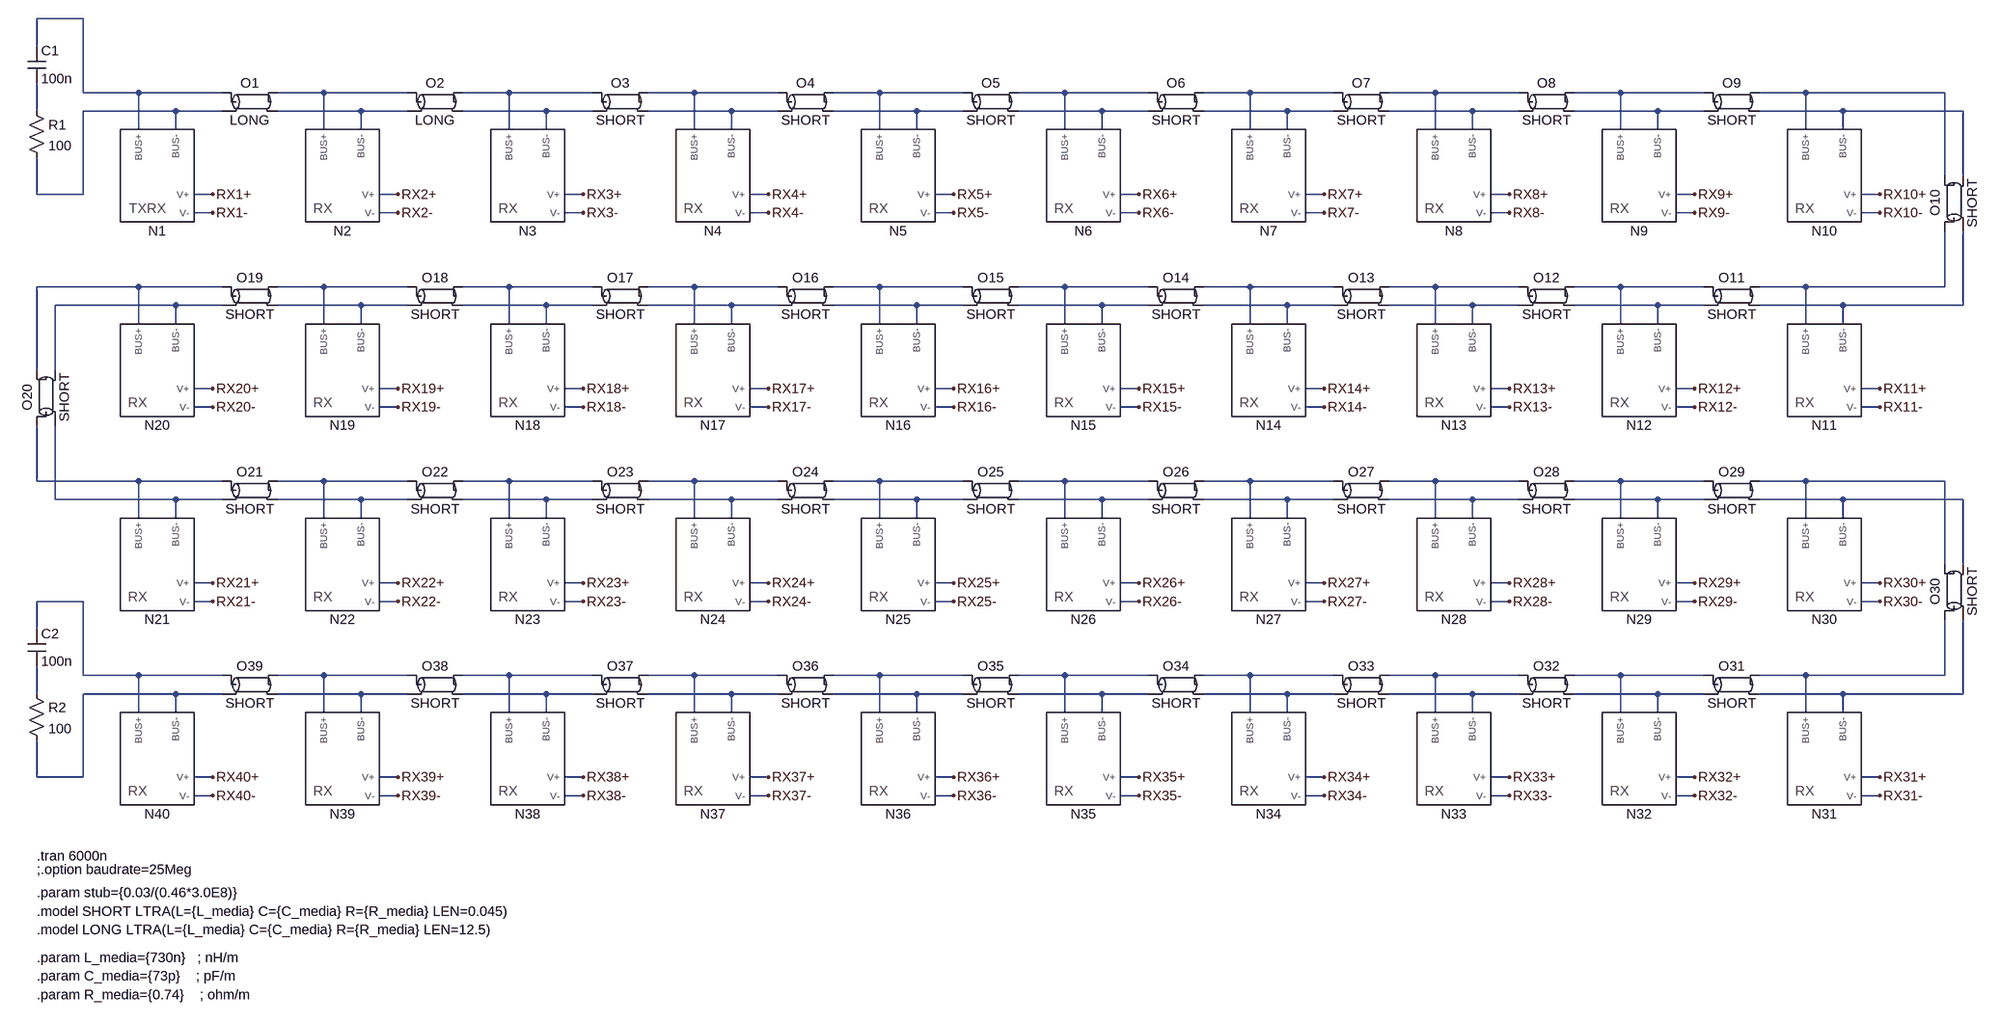
[diagram p0: schematic Multidrop_Bus.asc]
Multidrop_Bus.asc, the LTspice schematic file:
Version 4
SHEET 1 4756 1620
WIRE 1152 -640 1072 -640
WIRE 1072 -592 1072 -640
WIRE 1152 -512 1152 -640
WIRE 1248 -512 1152 -512
WIRE 1392 -512 1248 -512
WIRE 1568 -512 1488 -512
WIRE 1712 -512 1568 -512
WIRE 1888 -512 1808 -512
WIRE 2032 -512 1888 -512
WIRE 2208 -512 2128 -512
WIRE 2352 -512 2208 -512
WIRE 2528 -512 2448 -512
WIRE 2672 -512 2528 -512
WIRE 2848 -512 2768 -512
WIRE 2992 -512 2848 -512
WIRE 3168 -512 3088 -512
WIRE 3312 -512 3168 -512
WIRE 3488 -512 3408 -512
WIRE 3632 -512 3488 -512
WIRE 3808 -512 3728 -512
WIRE 3952 -512 3808 -512
WIRE 4128 -512 4048 -512
WIRE 4368 -512 4128 -512
WIRE 1072 -480 1072 -528
WIRE 1312 -480 1152 -480
WIRE 1392 -480 1312 -480
WIRE 1632 -480 1488 -480
WIRE 1712 -480 1632 -480
WIRE 1952 -480 1808 -480
WIRE 2032 -480 1952 -480
WIRE 2272 -480 2128 -480
WIRE 2352 -480 2272 -480
WIRE 2592 -480 2448 -480
WIRE 2672 -480 2592 -480
WIRE 2912 -480 2768 -480
WIRE 2992 -480 2912 -480
WIRE 3232 -480 3088 -480
WIRE 3312 -480 3232 -480
WIRE 3552 -480 3408 -480
WIRE 3632 -480 3552 -480
WIRE 3872 -480 3728 -480
WIRE 3952 -480 3872 -480
WIRE 4192 -480 4048 -480
WIRE 4400 -480 4192 -480
WIRE 1248 -448 1248 -512
WIRE 1312 -448 1312 -480
WIRE 1568 -448 1568 -512
WIRE 1632 -448 1632 -480
WIRE 1888 -448 1888 -512
WIRE 1952 -448 1952 -480
WIRE 2208 -448 2208 -512
WIRE 2272 -448 2272 -480
WIRE 2528 -448 2528 -512
WIRE 2592 -448 2592 -480
WIRE 2848 -448 2848 -512
WIRE 2912 -448 2912 -480
WIRE 3168 -448 3168 -512
WIRE 3232 -448 3232 -480
WIRE 3488 -448 3488 -512
WIRE 3552 -448 3552 -480
WIRE 3808 -448 3808 -512
WIRE 3872 -448 3872 -480
WIRE 4128 -448 4128 -512
WIRE 4192 -448 4192 -480
WIRE 4368 -368 4368 -512
WIRE 4400 -368 4400 -480
WIRE 1072 -336 1072 -400
WIRE 1152 -336 1152 -480
WIRE 1152 -336 1072 -336
WIRE 1376 -336 1344 -336
WIRE 1696 -336 1664 -336
WIRE 2016 -336 1984 -336
WIRE 2336 -336 2304 -336
WIRE 2656 -336 2624 -336
WIRE 2976 -336 2944 -336
WIRE 3296 -336 3264 -336
WIRE 3616 -336 3584 -336
WIRE 3936 -336 3904 -336
WIRE 4256 -336 4224 -336
WIRE 1376 -304 1344 -304
WIRE 1696 -304 1664 -304
WIRE 2016 -304 1984 -304
WIRE 2336 -304 2304 -304
WIRE 2656 -304 2624 -304
WIRE 2976 -304 2944 -304
WIRE 3296 -304 3264 -304
WIRE 3616 -304 3584 -304
WIRE 3936 -304 3904 -304
WIRE 4256 -304 4224 -304
WIRE 1248 -176 1072 -176
WIRE 1392 -176 1248 -176
WIRE 1568 -176 1488 -176
WIRE 1712 -176 1568 -176
WIRE 1888 -176 1808 -176
WIRE 2032 -176 1888 -176
WIRE 2208 -176 2128 -176
WIRE 2352 -176 2208 -176
WIRE 2528 -176 2448 -176
WIRE 2672 -176 2528 -176
WIRE 2848 -176 2768 -176
WIRE 2992 -176 2848 -176
WIRE 3168 -176 3088 -176
WIRE 3312 -176 3168 -176
WIRE 3488 -176 3408 -176
WIRE 3632 -176 3488 -176
WIRE 3808 -176 3728 -176
WIRE 3952 -176 3808 -176
WIRE 4128 -176 4048 -176
WIRE 4368 -176 4368 -272
WIRE 4368 -176 4128 -176
WIRE 1312 -144 1104 -144
WIRE 1392 -144 1312 -144
WIRE 1632 -144 1488 -144
WIRE 1712 -144 1632 -144
WIRE 1952 -144 1808 -144
WIRE 2032 -144 1952 -144
WIRE 2272 -144 2128 -144
WIRE 2352 -144 2272 -144
WIRE 2592 -144 2448 -144
WIRE 2672 -144 2592 -144
WIRE 2912 -144 2768 -144
WIRE 2992 -144 2912 -144
WIRE 3232 -144 3088 -144
WIRE 3312 -144 3232 -144
WIRE 3552 -144 3408 -144
WIRE 3632 -144 3552 -144
WIRE 3872 -144 3728 -144
WIRE 3952 -144 3872 -144
WIRE 4192 -144 4048 -144
WIRE 4400 -144 4400 -272
WIRE 4400 -144 4192 -144
WIRE 1248 -112 1248 -176
WIRE 1312 -112 1312 -144
WIRE 1568 -112 1568 -176
WIRE 1632 -112 1632 -144
WIRE 1888 -112 1888 -176
WIRE 1952 -112 1952 -144
WIRE 2208 -112 2208 -176
WIRE 2272 -112 2272 -144
WIRE 2528 -112 2528 -176
WIRE 2592 -112 2592 -144
WIRE 2848 -112 2848 -176
WIRE 2912 -112 2912 -144
WIRE 3168 -112 3168 -176
WIRE 3232 -112 3232 -144
WIRE 3488 -112 3488 -176
WIRE 3552 -112 3552 -144
WIRE 3808 -112 3808 -176
WIRE 3872 -112 3872 -144
WIRE 4128 -112 4128 -176
WIRE 4192 -112 4192 -144
WIRE 1072 -32 1072 -176
WIRE 1104 -32 1104 -144
WIRE 1376 0 1344 0
WIRE 1696 0 1664 0
WIRE 2016 0 1984 0
WIRE 2336 0 2304 0
WIRE 2656 0 2624 0
WIRE 2976 0 2944 0
WIRE 3296 0 3264 0
WIRE 3616 0 3584 0
WIRE 3936 0 3904 0
WIRE 4256 0 4224 0
WIRE 1376 32 1344 32
WIRE 1696 32 1664 32
WIRE 2016 32 1984 32
WIRE 2336 32 2304 32
WIRE 2656 32 2624 32
WIRE 2976 32 2944 32
WIRE 3296 32 3264 32
WIRE 3616 32 3584 32
WIRE 3936 32 3904 32
WIRE 4256 32 4224 32
WIRE 1072 160 1072 64
WIRE 1248 160 1072 160
WIRE 1392 160 1248 160
WIRE 1568 160 1488 160
WIRE 1712 160 1568 160
WIRE 1888 160 1808 160
WIRE 2032 160 1888 160
WIRE 2208 160 2128 160
WIRE 2352 160 2208 160
WIRE 2528 160 2448 160
WIRE 2672 160 2528 160
WIRE 2848 160 2768 160
WIRE 2992 160 2848 160
WIRE 3168 160 3088 160
WIRE 3312 160 3168 160
WIRE 3488 160 3408 160
WIRE 3632 160 3488 160
WIRE 3808 160 3728 160
WIRE 3952 160 3808 160
WIRE 4128 160 4048 160
WIRE 4368 160 4128 160
WIRE 1104 192 1104 64
WIRE 1312 192 1104 192
WIRE 1392 192 1312 192
WIRE 1632 192 1488 192
WIRE 1712 192 1632 192
WIRE 1952 192 1808 192
WIRE 2032 192 1952 192
WIRE 2272 192 2128 192
WIRE 2352 192 2272 192
WIRE 2592 192 2448 192
WIRE 2672 192 2592 192
WIRE 2912 192 2768 192
WIRE 2992 192 2912 192
WIRE 3232 192 3088 192
WIRE 3312 192 3232 192
WIRE 3552 192 3408 192
WIRE 3632 192 3552 192
WIRE 3872 192 3728 192
WIRE 3952 192 3872 192
WIRE 4192 192 4048 192
WIRE 4400 192 4192 192
WIRE 1248 224 1248 160
WIRE 1312 224 1312 192
WIRE 1568 224 1568 160
WIRE 1632 224 1632 192
WIRE 1888 224 1888 160
WIRE 1952 224 1952 192
WIRE 2208 224 2208 160
WIRE 2272 224 2272 192
WIRE 2528 224 2528 160
WIRE 2592 224 2592 192
WIRE 2848 224 2848 160
WIRE 2912 224 2912 192
WIRE 3168 224 3168 160
WIRE 3232 224 3232 192
WIRE 3488 224 3488 160
WIRE 3552 224 3552 192
WIRE 3808 224 3808 160
WIRE 3872 224 3872 192
WIRE 4128 224 4128 160
WIRE 4192 224 4192 192
WIRE 4368 304 4368 160
WIRE 4400 304 4400 192
WIRE 1376 336 1344 336
WIRE 1696 336 1664 336
WIRE 2016 336 1984 336
WIRE 2336 336 2304 336
WIRE 2656 336 2624 336
WIRE 2976 336 2944 336
WIRE 3296 336 3264 336
WIRE 3616 336 3584 336
WIRE 3936 336 3904 336
WIRE 4256 336 4224 336
WIRE 1152 368 1072 368
WIRE 1376 368 1344 368
WIRE 1696 368 1664 368
WIRE 2016 368 1984 368
WIRE 2336 368 2304 368
WIRE 2656 368 2624 368
WIRE 2976 368 2944 368
WIRE 3296 368 3264 368
WIRE 3616 368 3584 368
WIRE 3936 368 3904 368
WIRE 4256 368 4224 368
WIRE 1072 416 1072 368
WIRE 1152 496 1152 368
WIRE 1248 496 1152 496
WIRE 1392 496 1248 496
WIRE 1568 496 1488 496
WIRE 1712 496 1568 496
WIRE 1888 496 1808 496
WIRE 2032 496 1888 496
WIRE 2208 496 2128 496
WIRE 2352 496 2208 496
WIRE 2528 496 2448 496
WIRE 2672 496 2528 496
WIRE 2848 496 2768 496
WIRE 2992 496 2848 496
WIRE 3168 496 3088 496
WIRE 3312 496 3168 496
WIRE 3488 496 3408 496
WIRE 3632 496 3488 496
WIRE 3808 496 3728 496
WIRE 3952 496 3808 496
WIRE 4128 496 4048 496
WIRE 4368 496 4368 400
WIRE 4368 496 4128 496
WIRE 1072 528 1072 480
WIRE 1312 528 1152 528
WIRE 1392 528 1312 528
WIRE 1632 528 1488 528
WIRE 1712 528 1632 528
WIRE 1952 528 1808 528
WIRE 2032 528 1952 528
WIRE 2272 528 2128 528
WIRE 2352 528 2272 528
WIRE 2592 528 2448 528
WIRE 2672 528 2592 528
WIRE 2912 528 2768 528
WIRE 2992 528 2912 528
WIRE 3232 528 3088 528
WIRE 3312 528 3232 528
WIRE 3552 528 3408 528
WIRE 3632 528 3552 528
WIRE 3872 528 3728 528
WIRE 3952 528 3872 528
WIRE 4192 528 4048 528
WIRE 4400 528 4400 400
WIRE 4400 528 4192 528
WIRE 1248 560 1248 496
WIRE 1312 560 1312 528
WIRE 1568 560 1568 496
WIRE 1632 560 1632 528
WIRE 1888 560 1888 496
WIRE 1952 560 1952 528
WIRE 2208 560 2208 496
WIRE 2272 560 2272 528
WIRE 2528 560 2528 496
WIRE 2592 560 2592 528
WIRE 2848 560 2848 496
WIRE 2912 560 2912 528
WIRE 3168 560 3168 496
WIRE 3232 560 3232 528
WIRE 3488 560 3488 496
WIRE 3552 560 3552 528
WIRE 3808 560 3808 496
WIRE 3872 560 3872 528
WIRE 4128 560 4128 496
WIRE 4192 560 4192 528
WIRE 1072 672 1072 608
WIRE 1152 672 1152 528
WIRE 1152 672 1072 672
WIRE 1376 672 1344 672
WIRE 1696 672 1664 672
WIRE 2016 672 1984 672
WIRE 2336 672 2304 672
WIRE 2656 672 2624 672
WIRE 2976 672 2944 672
WIRE 3296 672 3264 672
WIRE 3616 672 3584 672
WIRE 3936 672 3904 672
WIRE 4256 672 4224 672
WIRE 1376 704 1344 704
WIRE 1696 704 1664 704
WIRE 2016 704 1984 704
WIRE 2336 704 2304 704
WIRE 2656 704 2624 704
WIRE 2976 704 2944 704
WIRE 3296 704 3264 704
WIRE 3616 704 3584 704
WIRE 3936 704 3904 704
WIRE 4256 704 4224 704
FLAG 1376 -336 RX1+
FLAG 1376 -304 RX1-
FLAG 1696 -304 RX2-
FLAG 2016 -304 RX3-
FLAG 2336 -304 RX4-
FLAG 2656 -304 RX5-
FLAG 2976 -304 RX6-
FLAG 1696 -336 RX2+
FLAG 2016 -336 RX3+
FLAG 2336 -336 RX4+
FLAG 2656 -336 RX5+
FLAG 2976 -336 RX6+
FLAG 3296 -336 RX7+
FLAG 3616 -336 RX8+
FLAG 3936 -336 RX9+
FLAG 4256 -336 RX10+
FLAG 3296 -304 RX7-
FLAG 3616 -304 RX8-
FLAG 3936 -304 RX9-
FLAG 4256 -304 RX10-
FLAG 4256 0 RX11+
FLAG 3936 0 RX12+
FLAG 3616 0 RX13+
FLAG 3296 0 RX14+
FLAG 2976 0 RX15+
FLAG 2656 0 RX16+
FLAG 4256 32 RX11-
FLAG 3936 32 RX12-
FLAG 3616 32 RX13-
FLAG 3296 32 RX14-
FLAG 2976 32 RX15-
FLAG 2656 32 RX16-
FLAG 2336 0 RX17+
FLAG 2016 0 RX18+
FLAG 1696 0 RX19+
FLAG 1376 0 RX20+
FLAG 2336 32 RX17-
FLAG 2016 32 RX18-
FLAG 1696 32 RX19-
FLAG 1376 32 RX20-
FLAG 1376 336 RX21+
FLAG 1696 336 RX22+
FLAG 2016 336 RX23+
FLAG 2336 336 RX24+
FLAG 2656 336 RX25+
FLAG 1376 368 RX21-
FLAG 1696 368 RX22-
FLAG 2016 368 RX23-
FLAG 2336 368 RX24-
FLAG 2656 368 RX25-
FLAG 2976 336 RX26+
FLAG 3296 336 RX27+
FLAG 3616 336 RX28+
FLAG 3936 336 RX29+
FLAG 4256 336 RX30+
FLAG 2976 368 RX26-
FLAG 3296 368 RX27-
FLAG 3616 368 RX28-
FLAG 3936 368 RX29-
FLAG 4256 368 RX30-
FLAG 4256 672 RX31+
FLAG 3936 672 RX32+
FLAG 3616 672 RX33+
FLAG 3296 672 RX34+
FLAG 2976 672 RX35+
FLAG 2656 672 RX36+
FLAG 4256 704 RX31-
FLAG 3936 704 RX32-
FLAG 3616 704 RX33-
FLAG 3296 704 RX34-
FLAG 2976 704 RX35-
FLAG 2656 704 RX36-
FLAG 2336 672 RX37+
FLAG 2016 672 RX38+
FLAG 1696 672 RX39+
FLAG 1376 672 RX40+
FLAG 2336 704 RX37-
FLAG 2016 704 RX38-
FLAG 1696 704 RX39-
FLAG 1376 704 RX40-
SYMBOL res 1056 -496 R0
SYMATTR InstName R1
SYMATTR Value 100
SYMBOL cap 1056 -592 R0
SYMATTR InstName C1
SYMATTR Value 100n
SYMBOL Transceiver 1280 -384 R0
SYMATTR InstName N1
SYMBOL Receiver 1600 -416 R0
SYMATTR InstName N2
SYMBOL Receiver 1920 -416 R0
SYMATTR InstName N3
SYMBOL Receiver 2240 -416 R0
SYMATTR InstName N4
SYMBOL Receiver 2560 -416 R0
SYMATTR InstName N5
SYMBOL Receiver 2880 -416 R0
SYMATTR InstName N6
SYMBOL Receiver 3200 -416 R0
SYMATTR InstName N7
SYMBOL Receiver 3520 -416 R0
SYMATTR InstName N8
SYMBOL Receiver 3840 -416 R0
SYMATTR InstName N9
SYMBOL Receiver 4160 -416 R0
SYMATTR InstName N10
SYMBOL res 1056 512 R0
SYMATTR InstName R2
SYMATTR Value 100
SYMBOL cap 1056 416 R0
SYMATTR InstName C2
SYMATTR Value 100n
SYMBOL Receiver 3840 -80 R0
SYMATTR InstName N12
SYMBOL Receiver 3520 -80 R0
SYMATTR InstName N13
SYMBOL Receiver 3200 -80 R0
SYMATTR InstName N14
SYMBOL Receiver 2880 -80 R0
SYMATTR InstName N15
SYMBOL Receiver 2560 -80 R0
SYMATTR InstName N16
SYMBOL Receiver 2240 -80 R0
SYMATTR InstName N17
SYMBOL Receiver 1920 -80 R0
SYMATTR InstName N18
SYMBOL Receiver 1600 -80 R0
SYMATTR InstName N19
SYMBOL Receiver 1280 -80 R0
SYMATTR InstName N20
SYMBOL Receiver 4160 -80 R0
SYMATTR InstName N11
SYMBOL Receiver 1600 256 R0
SYMATTR InstName N22
SYMBOL Receiver 1920 256 R0
SYMATTR InstName N23
SYMBOL Receiver 2240 256 R0
SYMATTR InstName N24
SYMBOL Receiver 2560 256 R0
SYMATTR InstName N25
SYMBOL Receiver 2880 256 R0
SYMATTR InstName N26
SYMBOL Receiver 3200 256 R0
SYMATTR InstName N27
SYMBOL Receiver 3520 256 R0
SYMATTR InstName N28
SYMBOL Receiver 3840 256 R0
SYMATTR InstName N29
SYMBOL Receiver 4160 256 R0
SYMATTR InstName N30
SYMBOL Receiver 1600 592 R0
SYMATTR InstName N39
SYMBOL Receiver 1920 592 R0
SYMATTR InstName N38
SYMBOL Receiver 2560 592 R0
SYMATTR InstName N36
SYMBOL Receiver 2880 592 R0
SYMATTR InstName N35
SYMBOL Receiver 3200 592 R0
SYMATTR InstName N34
SYMBOL Receiver 3520 592 R0
SYMATTR InstName N33
SYMBOL Receiver 3840 592 R0
SYMATTR InstName N32
SYMBOL Receiver 4160 592 R0
SYMATTR InstName N31
SYMBOL Receiver 1280 592 R0
SYMATTR InstName N40
SYMBOL Receiver 1280 256 R0
SYMATTR InstName N21
SYMBOL Receiver 2240 592 R0
SYMATTR InstName N37
SYMBOL ltline 1440 -496 R0
SYMATTR InstName O1
SYMATTR Value LONG
SYMBOL ltline 1760 -496 R0
SYMATTR InstName O2
SYMATTR Value LONG
SYMBOL ltline 2080 -496 R0
SYMATTR InstName O3
SYMATTR Value SHORT
SYMBOL ltline 2400 -496 R0
SYMATTR InstName O4
SYMATTR Value SHORT
SYMBOL ltline 2720 -496 R0
SYMATTR InstName O5
SYMATTR Value SHORT
SYMBOL ltline 3040 -496 R0
SYMATTR InstName O6
SYMATTR Value SHORT
SYMBOL ltline 3360 -496 R0
SYMATTR InstName O7
SYMATTR Value SHORT
SYMBOL ltline 3680 -496 R0
SYMATTR InstName O8
SYMATTR Value SHORT
SYMBOL ltline 4000 -496 R0
SYMATTR InstName O9
SYMATTR Value SHORT
SYMBOL ltline 4000 -160 R0
SYMATTR InstName O11
SYMATTR Value SHORT
SYMBOL ltline 3680 -160 R0
SYMATTR InstName O12
SYMATTR Value SHORT
SYMBOL ltline 3360 -160 R0
SYMATTR InstName O13
SYMATTR Value SHORT
SYMBOL ltline 3040 -160 R0
SYMATTR InstName O14
SYMATTR Value SHORT
SYMBOL ltline 2720 -160 R0
SYMATTR InstName O15
SYMATTR Value SHORT
SYMBOL ltline 2400 -160 R0
SYMATTR InstName O16
SYMATTR Value SHORT
SYMBOL ltline 2080 -160 R0
SYMATTR InstName O17
SYMATTR Value SHORT
SYMBOL ltline 1760 -160 R0
SYMATTR InstName O18
SYMATTR Value SHORT
SYMBOL ltline 1440 -160 R0
SYMATTR InstName O19
SYMATTR Value SHORT
SYMBOL ltline 1088 16 R270
SYMATTR InstName O20
SYMATTR Value SHORT
SYMBOL ltline 4384 -320 R270
SYMATTR InstName O10
SYMATTR Value SHORT
SYMBOL ltline 1440 176 R0
SYMATTR InstName O21
SYMATTR Value SHORT
SYMBOL ltline 1760 176 R0
SYMATTR InstName O22
SYMATTR Value SHORT
SYMBOL ltline 2080 176 R0
SYMATTR InstName O23
SYMATTR Value SHORT
SYMBOL ltline 2400 176 R0
SYMATTR InstName O24
SYMATTR Value SHORT
SYMBOL ltline 2720 176 R0
SYMATTR InstName O25
SYMATTR Value SHORT
SYMBOL ltline 3040 176 R0
SYMATTR InstName O26
SYMATTR Value SHORT
SYMBOL ltline 3360 176 R0
SYMATTR InstName O27
SYMATTR Value SHORT
SYMBOL ltline 3680 176 R0
SYMATTR InstName O28
SYMATTR Value SHORT
SYMBOL ltline 4000 176 R0
SYMATTR InstName O29
SYMATTR Value SHORT
SYMBOL ltline 4384 352 R270
SYMATTR InstName O30
SYMATTR Value SHORT
SYMBOL ltline 4000 512 R0
SYMATTR InstName O31
SYMATTR Value SHORT
SYMBOL ltline 3680 512 R0
SYMATTR InstName O32
SYMATTR Value SHORT
SYMBOL ltline 3360 512 R0
SYMATTR InstName O33
SYMATTR Value SHORT
SYMBOL ltline 3040 512 R0
SYMATTR InstName O34
SYMATTR Value SHORT
SYMBOL ltline 2720 512 R0
SYMATTR InstName O35
SYMATTR Value SHORT
SYMBOL ltline 2400 512 R0
SYMATTR InstName O36
SYMATTR Value SHORT
SYMBOL ltline 2080 512 R0
SYMATTR InstName O37
SYMATTR Value SHORT
SYMBOL ltline 1760 512 R0
SYMATTR InstName O38
SYMATTR Value SHORT
SYMBOL ltline 1440 512 R0
SYMATTR InstName O39
SYMATTR Value SHORT
TEXT 1072 808 Left 2 !.tran 6000n
TEXT 1072 832 Left 2 !;.option baudrate=25Meg
TEXT 1072 872 Left 2 !.param stub={0.03/(0.46*3.0E8)}
TEXT 1072 904 Left 2 !.model SHORT LTRA(L={L_media} C={C_media} R={R_media} LEN=0.045)
TEXT 1072 936 Left 2 !.model LONG LTRA(L={L_media} C={C_media} R={R_media} LEN=12.5)
TEXT 1072 984 Left 2 !.param L_media={730n}   ; nH/m
TEXT 1072 1016 Left 2 !.param C_media={73p}    ; pF/m
TEXT 1072 1048 Left 2 !.param R_media={0.74}    ; ohm/m

The netlist it stands for:
* Multidrop_Bus.asc
R1 N011 N012 100
C1 N001 N011 100n
XN1 N001 N012 RX1+ RX1- Transceiver  ; pins BUS+ BUS- V+ V-
XN2 N002 N013 RX2+ RX2- Receiver  ; pins BUS+ BUS- V+ V-
XN3 N003 N014 RX3+ RX3- Receiver  ; pins BUS+ BUS- V+ V-
XN4 N004 N015 RX4+ RX4- Receiver  ; pins BUS+ BUS- V+ V-
XN5 N005 N016 RX5+ RX5- Receiver  ; pins BUS+ BUS- V+ V-
XN6 N006 N017 RX6+ RX6- Receiver  ; pins BUS+ BUS- V+ V-
XN7 N007 N018 RX7+ RX7- Receiver  ; pins BUS+ BUS- V+ V-
XN8 N008 N019 RX8+ RX8- Receiver  ; pins BUS+ BUS- V+ V-
XN9 N009 N020 RX9+ RX9- Receiver  ; pins BUS+ BUS- V+ V-
XN10 N010 N021 RX10+ RX10- Receiver  ; pins BUS+ BUS- V+ V-
R2 N072 N073 100
C2 N062 N072 100n
XN12 N030 N040 RX12+ RX12- Receiver  ; pins BUS+ BUS- V+ V-
XN13 N029 N039 RX13+ RX13- Receiver  ; pins BUS+ BUS- V+ V-
XN14 N028 N038 RX14+ RX14- Receiver  ; pins BUS+ BUS- V+ V-
XN15 N027 N037 RX15+ RX15- Receiver  ; pins BUS+ BUS- V+ V-
XN16 N026 N036 RX16+ RX16- Receiver  ; pins BUS+ BUS- V+ V-
XN17 N025 N035 RX17+ RX17- Receiver  ; pins BUS+ BUS- V+ V-
XN18 N024 N034 RX18+ RX18- Receiver  ; pins BUS+ BUS- V+ V-
XN19 N023 N033 RX19+ RX19- Receiver  ; pins BUS+ BUS- V+ V-
XN20 N022 N032 RX20+ RX20- Receiver  ; pins BUS+ BUS- V+ V-
XN11 N031 N041 RX11+ RX11- Receiver  ; pins BUS+ BUS- V+ V-
XN22 N043 N053 RX22+ RX22- Receiver  ; pins BUS+ BUS- V+ V-
XN23 N044 N054 RX23+ RX23- Receiver  ; pins BUS+ BUS- V+ V-
XN24 N045 N055 RX24+ RX24- Receiver  ; pins BUS+ BUS- V+ V-
XN25 N046 N056 RX25+ RX25- Receiver  ; pins BUS+ BUS- V+ V-
XN26 N047 N057 RX26+ RX26- Receiver  ; pins BUS+ BUS- V+ V-
XN27 N048 N058 RX27+ RX27- Receiver  ; pins BUS+ BUS- V+ V-
XN28 N049 N059 RX28+ RX28- Receiver  ; pins BUS+ BUS- V+ V-
XN29 N050 N060 RX29+ RX29- Receiver  ; pins BUS+ BUS- V+ V-
XN30 N051 N061 RX30+ RX30- Receiver  ; pins BUS+ BUS- V+ V-
XN39 N063 N074 RX39+ RX39- Receiver  ; pins BUS+ BUS- V+ V-
XN38 N064 N075 RX38+ RX38- Receiver  ; pins BUS+ BUS- V+ V-
XN36 N066 N077 RX36+ RX36- Receiver  ; pins BUS+ BUS- V+ V-
XN35 N067 N078 RX35+ RX35- Receiver  ; pins BUS+ BUS- V+ V-
XN34 N068 N079 RX34+ RX34- Receiver  ; pins BUS+ BUS- V+ V-
XN33 N069 N080 RX33+ RX33- Receiver  ; pins BUS+ BUS- V+ V-
XN32 N070 N081 RX32+ RX32- Receiver  ; pins BUS+ BUS- V+ V-
XN31 N071 N082 RX31+ RX31- Receiver  ; pins BUS+ BUS- V+ V-
XN40 N062 N073 RX40+ RX40- Receiver  ; pins BUS+ BUS- V+ V-
XN21 N042 N052 RX21+ RX21- Receiver  ; pins BUS+ BUS- V+ V-
XN37 N065 N076 RX37+ RX37- Receiver  ; pins BUS+ BUS- V+ V-
O1 N001 N012 N002 N013 LONG
O2 N002 N013 N003 N014 LONG
O3 N003 N014 N004 N015 SHORT
O4 N004 N015 N005 N016 SHORT
O5 N005 N016 N006 N017 SHORT
O6 N006 N017 N007 N018 SHORT
O7 N007 N018 N008 N019 SHORT
O8 N008 N019 N009 N020 SHORT
O9 N009 N020 N010 N021 SHORT
O11 N030 N040 N031 N041 SHORT
O12 N029 N039 N030 N040 SHORT
O13 N028 N038 N029 N039 SHORT
O14 N027 N037 N028 N038 SHORT
O15 N026 N036 N027 N037 SHORT
O16 N025 N035 N026 N036 SHORT
O17 N024 N034 N025 N035 SHORT
O18 N023 N033 N024 N034 SHORT
O19 N022 N032 N023 N033 SHORT
O20 N042 N052 N022 N032 SHORT
O10 N031 N041 N010 N021 SHORT
O21 N042 N052 N043 N053 SHORT
O22 N043 N053 N044 N054 SHORT
O23 N044 N054 N045 N055 SHORT
O24 N045 N055 N046 N056 SHORT
O25 N046 N056 N047 N057 SHORT
O26 N047 N057 N048 N058 SHORT
O27 N048 N058 N049 N059 SHORT
O28 N049 N059 N050 N060 SHORT
O29 N050 N060 N051 N061 SHORT
O30 N071 N082 N051 N061 SHORT
O31 N070 N081 N071 N082 SHORT
O32 N069 N080 N070 N081 SHORT
O33 N068 N079 N069 N080 SHORT
O34 N067 N078 N068 N079 SHORT
O35 N066 N077 N067 N078 SHORT
O36 N065 N076 N066 N077 SHORT
O37 N064 N075 N065 N076 SHORT
O38 N063 N074 N064 N075 SHORT
O39 N062 N073 N063 N074 SHORT
.tran 6000n
;.option baudrate=25Meg
.param stub={0.03/(0.46*3.0E8)}
.model SHORT LTRA(L={L_media} C={C_media} R={R_media} LEN=0.045)
.model LONG LTRA(L={L_media} C={C_media} R={R_media} LEN=12.5)
.param L_media={730n}   ; nH/m
.param C_media={73p}    ; pF/m
.param R_media={0.74}    ; ohm/m
.backanno
.end